# EAGLE design quad-ref-clock (EAGLE 7.4.0)
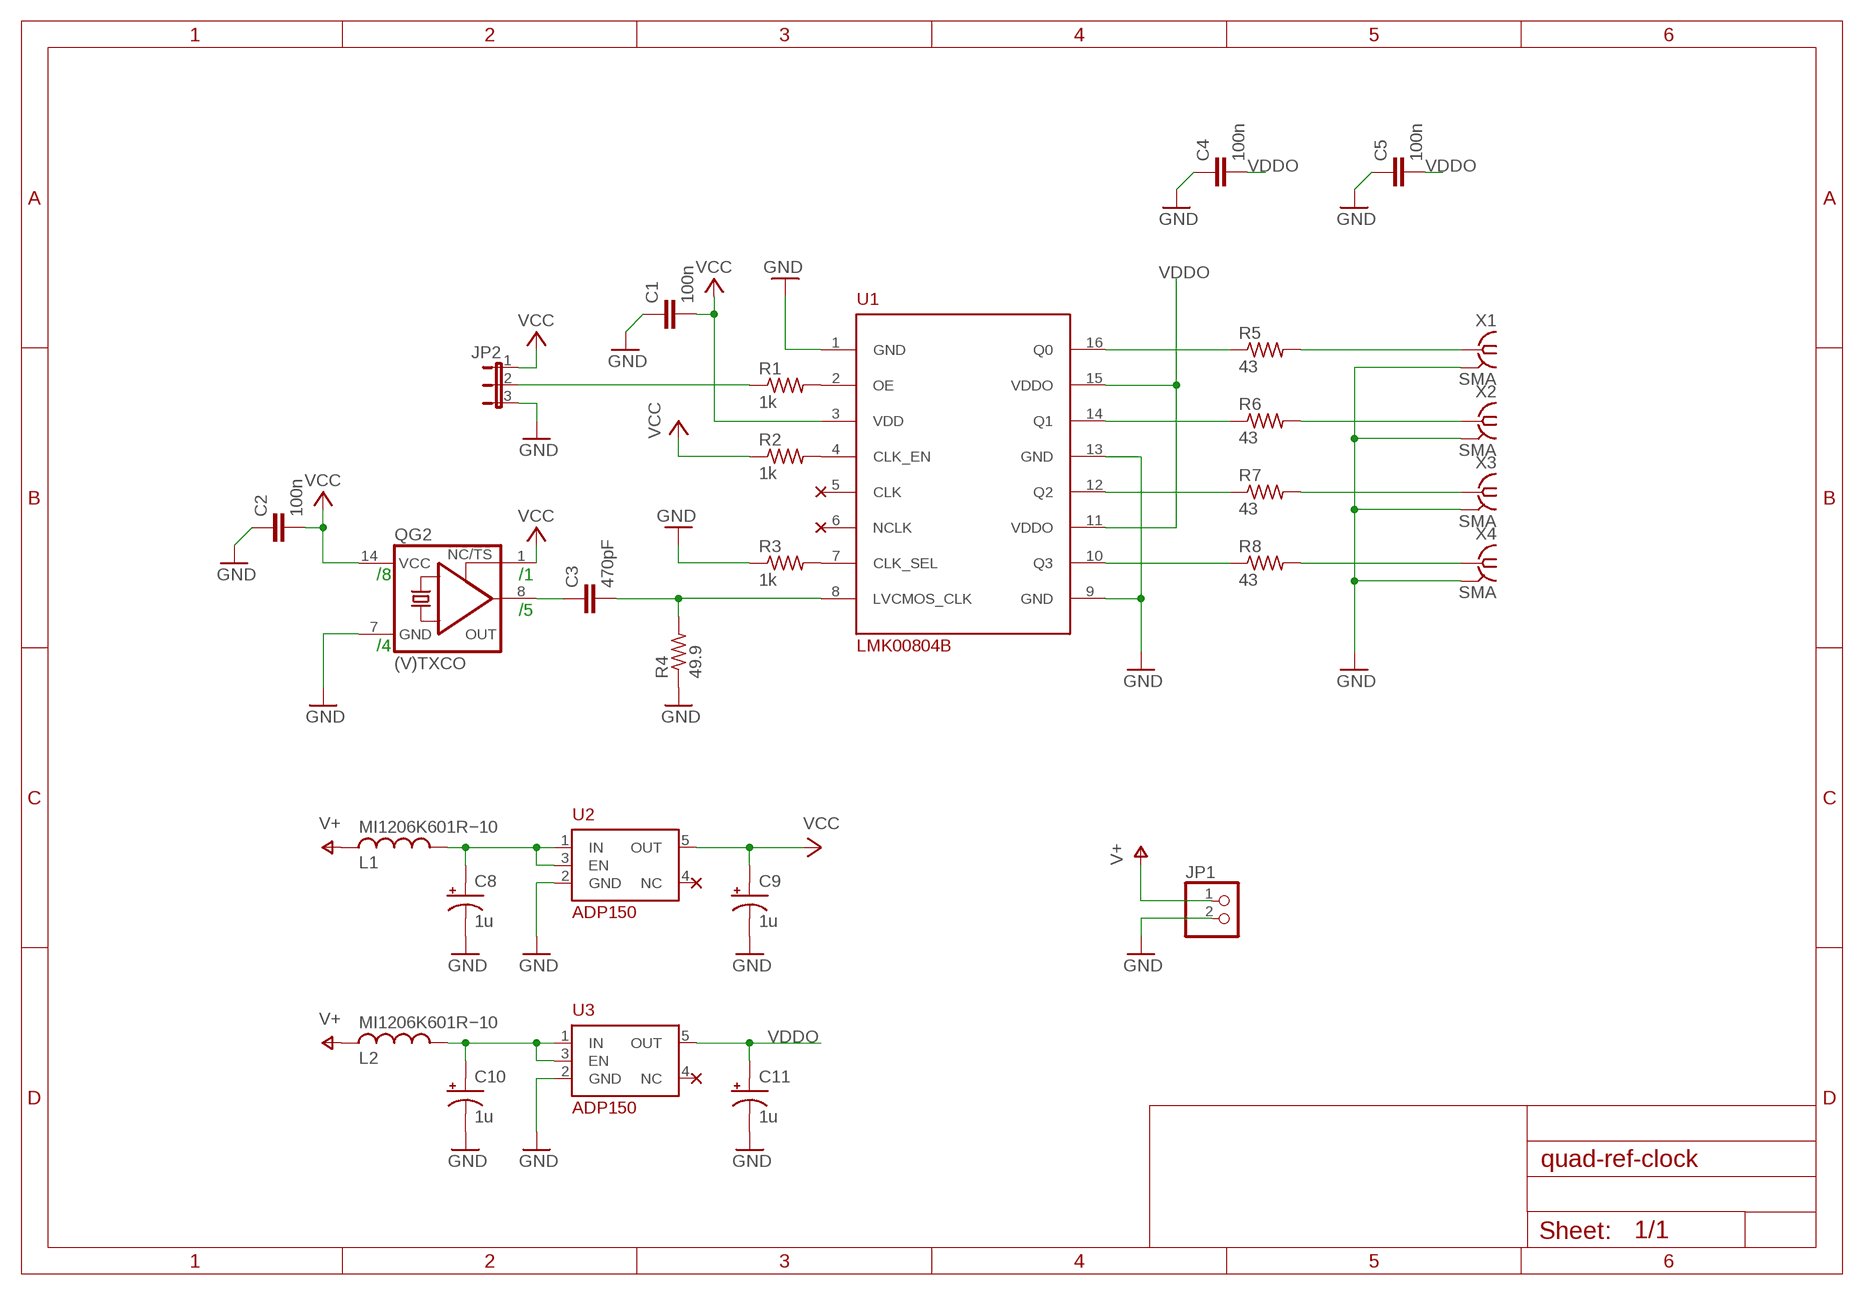
[diagram p0: schematic, sheet 1]

## Parts
C1  100n  C-EUC0805  [C0805]
C2  100n  C-EUC0805  [C0805]
C3  470pF  C-EUC0805  [C0805]
C4  100n  C-EUC0805  [C0805]
C5  100n  C-EUC0805  [C0805]
C8  1u  CAPACITOR_POL1012  [CAPACITOR_POL_1210]
C9  1u  CAPACITOR_POL1012  [CAPACITOR_POL_1210]
C10  1u  CAPACITOR_POL1012  [CAPACITOR_POL_1210]
C11  1u  CAPACITOR_POL1012  [CAPACITOR_POL_1210]
JP1  PINHD-1X2  [1X02]
JP2  JP2E  [JP2]
L1  MI1206K601R−10  L-USL3216C  [L3216C]
L2  MI1206K601R−10  L-USL3216C  [L3216C]
QG2  (V)TXCO  XO-14  [DIL14S]
R1  1k  R-US_R0805  [R0805]
R2  1k  R-US_R0805  [R0805]
R3  1k  R-US_R0805  [R0805]
R4  49.9  R-US_R0603  [R0603]
R5  43  R-US_R0603  [R0603]
R6  43  R-US_R0603  [R0603]
R7  43  R-US_R0603  [R0603]
R8  43  R-US_R0603  [R0603]
U1  LMK00804B  [LMK00804B]
U2  ADP150  [TSOT-23-5]
U3  ADP150  [TSOT-23-5]
U$1  NO-ERC-PAS  (no package)
U$2  NO-ERC-PAS  (no package)
X1  SMA  SMA-142-0711-881/886  [J502-ND-142-0711-881/886]
X2  SMA  SMA-142-0711-881/886  [J502-ND-142-0711-881/886]
X3  SMA  SMA-142-0711-881/886  [J502-ND-142-0711-881/886]
X4  SMA  SMA-142-0711-881/886  [J502-ND-142-0711-881/886]

## Nets
C2: C8.A L1.1 U2.1(IN) U2.3(EN)
GND: C1.1 C2.1 C4.1 C5.1 C8.C C9.C C10.C C11.C JP1.2 JP2.3 QG2.7(GND) R3.1 R4.1 U1.1(GND) U1.9(GND) U1.13(GND) U2.2(GND) U3.2(GND) X1.G@1 X1.G@2 X1.G@3 X1.G@4 X2.G@1 X2.G@2 X2.G@3 X2.G@4 X3.G@1 X3.G@2 X3.G@3 X3.G@4 X4.G@1 X4.G@2 X4.G@3 X4.G@4
N$1: R5.1 U1.16(Q0)
N$2: R6.1 U1.14(Q1)
N$3: R7.1 U1.12(Q2)
N$4: R8.1 U1.10(Q3)
N$5: R2.2 U1.4(CLK_EN)
N$6: R1.2 U1.2(OE)
N$7: C3.2 R4.2 U1.8(LVCMOS_CLK)
N$8: R3.2 U1.7(CLK_SEL)
N$10: R5.2 X1.1
N$11: R6.2 X2.1
N$12: R7.2 X3.1
N$13: R8.2 X4.1
N$14: U1.5(CLK) U$1.0
N$15: C3.1 QG2.8(OUT)
N$16: JP2.2 R1.1
N$17: U1.6(NCLK) U$2.0
N$18: C10.A L2.1 U3.1(IN) U3.3(EN)
V+: JP1.1 L1.2 L2.2
VCC: C1.2 C2.2 C9.A JP2.1 QG2.1(TS) QG2.14(VCC) R2.1 U1.3(VDD) U2.5(OUT)
VDDO: C4.2 C5.2 C11.A U1.11(VDDO) U1.15(VDDO) U3.5(OUT)
Unconnected: U2.4(NC) U3.4(NC)

## Notes on the sheet
- /8 | /1
- /5
- /4

## Library data of the parts
C1-C5 = rcl:C-EU: CAPACITOR, European symbol
C8-C11 = radiotelescope:CAPACITOR_POL
JP1 = pinhead:PINHD-1X2: PIN HEADER
JP2 = jumper:JP2E: JUMPER
L1 L2 = rcl:L-US: INDUCTOR, American symbol
QG2 = crystal:XO-: CRYSTAL; OC_FARNELL: unknown; OC_NEWARK: unknown
R1-R8 = rcl:R-US_: RESISTOR, American symbol
U1 = quad-ref-clock:LMK00804B
U2 U3 = quad-ref-clock:ADP150
U$1 U$2 = quad-ref-clock:NO-ERC-PAS
X1-X4 = con-coax:SMA-: SMA 50 Ohm End Launch Jack Receptacle - Round Contact Johnson Components Source: www.johnsoncomponents.com .. J502-ND.pdf; MF: JOHNSON COMPONENTS; MPN: 142-0711-881; OC_FARNELL: unknown; OC_NEWARK: 50B4464

## Board
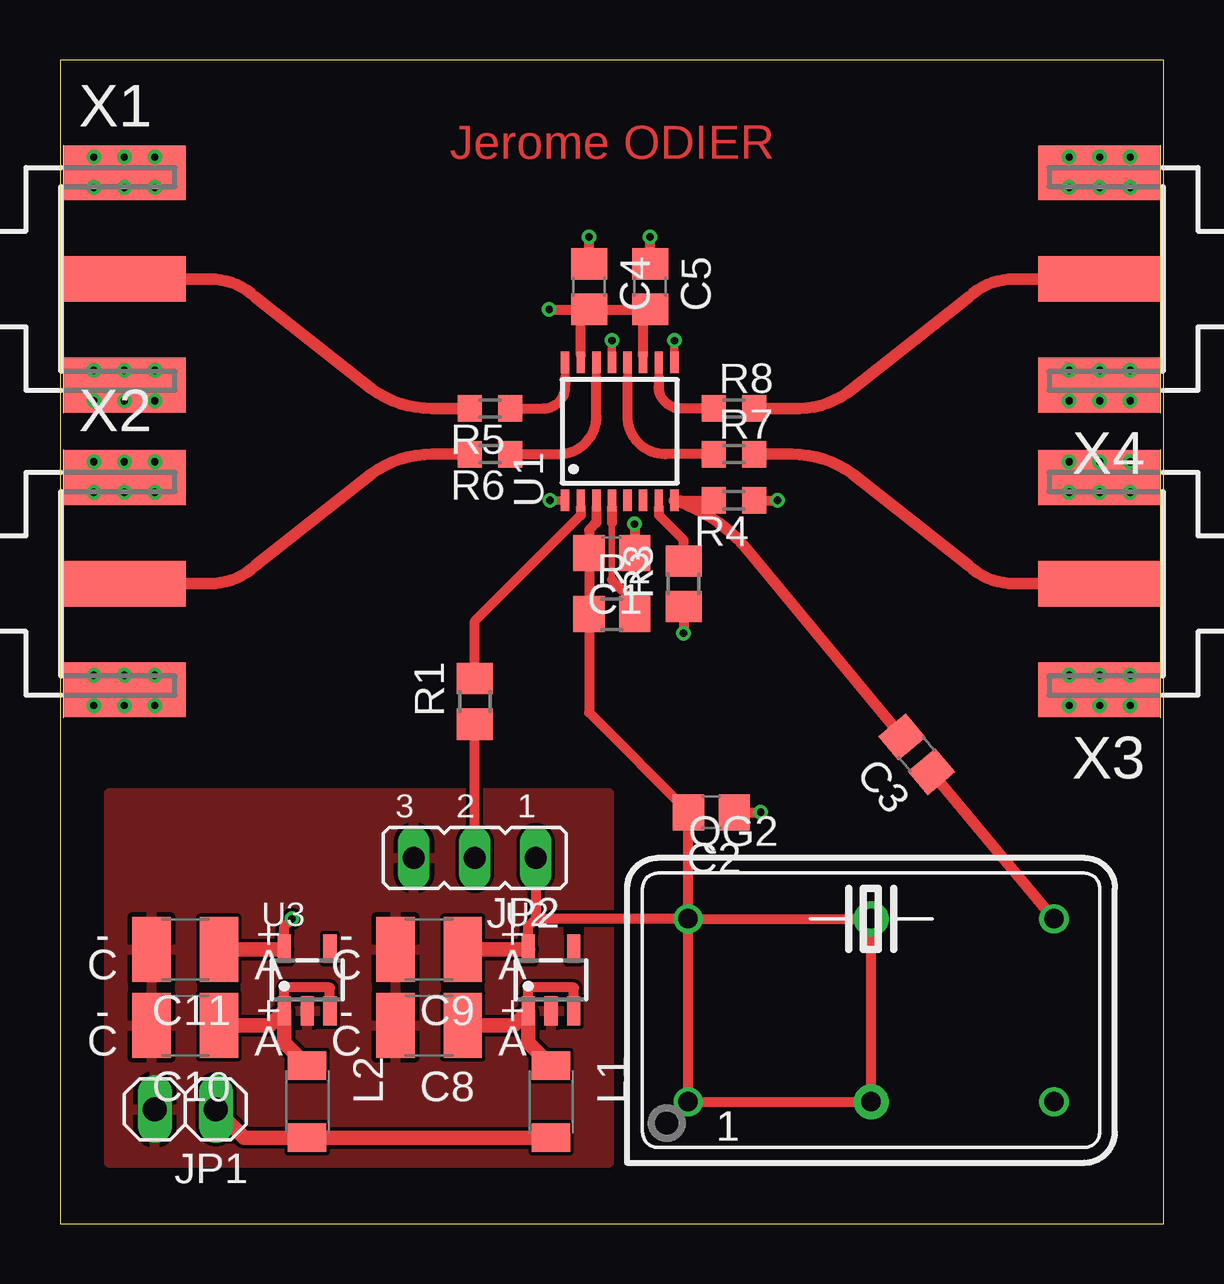
[diagram p1: board, top side]
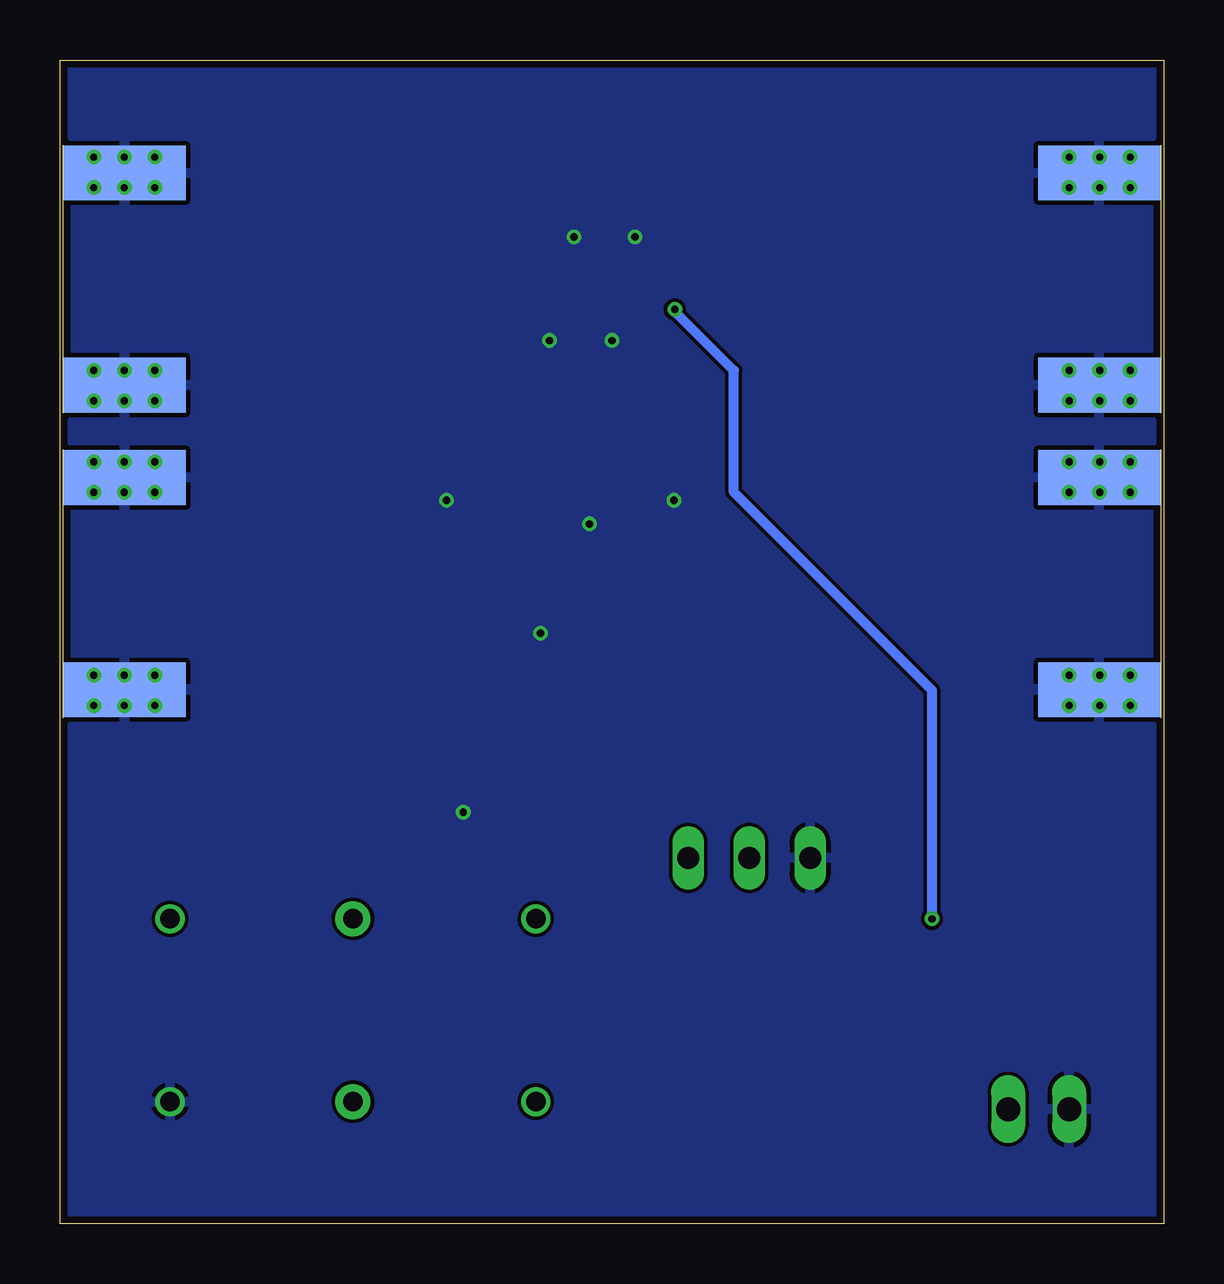
[diagram p2: board, bottom side, seen from below]

Size 46 x 48.5 mm. Coordinates in mm from the lower left corner, seen from the top.
Outline: 0,0 46,0 46,48.5 0,48.5 0,0
Copper layers (1*16): Top 0.035mm / dielectric 1.5mm / Bottom 0.035mm
Design rules "PCB-POOL Standard": minimum track width 0.15mm, minimum drill 0.3mm, track to track 0.15mm, track to pad 0.15mm, pad to pad 0.15mm, via to via 0.15mm, smd to smd 0.15mm, copper to edge 0.3mm, drill to drill 0.2mm, minimum pad ring 0.2mm, minimum via ring 0.15mm, stop-mask expansion 0.075mm, vias tented up to drill 0mil, thermal gap 0.2mm

### Footprints (pad centres in the part's own frame; a part is rotated, then mirrored left to right if it is on the bottom)
C0805 = smd 1.3 x 1.5: 1 -0.95,0; 2 0.95,0
CAPACITOR_POL_1210 = smd 1.6 x 2.7: A -1.4,0; C 1.4,0
1X02 = drill 1.016 long: 1 -1.27,0; 2 1.27,0
JP2 = drill 0.914 long: 1 -2.54,0; 2 0,0; 3 2.54,0
L3216C = smd 1.2 x 1.6: 1 -1.5,0; 2 1.5,0
DIL14S = drill 0.813: 1 -7.62,-3.81; 7 7.62,-3.81; 8 7.62,3.81; 14 -7.62,3.81
R0805 = smd 1.3 x 1.5: 1 -0.95,0; 2 0.95,0
R0603 = smd 1 x 1.1: 1 -0.85,0; 2 0.85,0
LMK00804B = smd 0.9 x 0.35: 1 -2.875,2.275; 2 -2.875,1.625; 3 -2.875,0.975; 4 -2.875,0.325; 5 -2.875,-0.325; 6 -2.875,-0.975; 7 -2.875,-1.625; 8 -2.875,-2.275; 9 2.875,-2.275; 10 2.875,-1.625; 11 2.875,-0.975; 12 2.875,-0.325; 13 2.875,0.325; 14 2.875,0.975; 15 2.875,1.625; 16 2.875,2.275
TSOT-23-5 = smd 0.55 x 1.2: 1 -0.95,-1.3; 2 0,-1.3; 3 0.95,-1.3; 4 0.95,1.3; 5 -0.95,1.3
J502-ND-142-0711-881/886 = smd 5.08 x 1.905: 1 2.565,0 | smd 5.08 x 2.286: G@1 2.565,4.42; G@2 2.565,-4.42 | smd 5.08 x 2.286 bottom: G@3 2.565,4.42; G@4 2.565,-4.42

### Placement (x,y rotation side)
C1  22.99,27.94 180 top
C2  27.14,17.14 180 top
C3  35.7,19.56 130 top
C4  22.05,39.05 270 top
C5  24.59,39.05 270 top
C8  15.38,8.26 180 top
C9  15.38,11.43 180 top
C10  5.22,8.26 180 top
C11  5.22,11.43 180 top
JP1  5.22,4.76 180 top
JP2  17.28,15.24 180 top
L1  20.46,5.08 270 top
L2  10.3,5.08 270 top
QG2  33.79,8.89 0 top
R1  17.28,21.76 90 top
R2  22.99,25.4 0 top
R3  25.98,26.67 90 top
R4  28.08,30.14 180 top
R5  17.92,33.97 180 top
R6  17.92,32.07 180 top
R7  28.08,32.07 0 top
R8  28.08,33.97 0 top
U1  23.32,33.02 90 top
U2  20.46,10.16 0 top
U3  10.3,10.16 0 top
X1  0.14,39.37 0 top
X2  0.14,26.67 0 top
X3  45.86,26.67 180 top
X4  45.86,39.37 180 top

### Tracks (layer width: path | path; a pad name or v marks a point on that pad's centre or on a via)
C2
  Top 0.406: U2.1 19.51,9.84 21.41,9.84 U2.3
  Top 0.61: L1.1 19.51,7.53 U2.1 18.9,8.26 C8.A
GND  (via drill 0.3)
  Top 0.35: v20.42,30.14 U1.1 | U1.13 v23,36.8 | U1.9 v25.6,36.8
  Top 0.406: v23.94,29.16 C1.1 | R3.1 v25.98,24.61 | R4.1 v29.9,30.14 | C4.1 v22.05,41.12 | C5.1 v24.59,41.12 | C2.1 v29.2,17.14
  other vias: 43.32,30.48 43.32,34.29 43.32,35.56 43.32,31.75 42.05,31.75 44.59,31.75 44.59,30.48 42.05,30.48 44.59,34.29 44.59,35.56 42.05,35.56 42.05,34.29 43.32,44.45 43.32,43.18 42.05,43.18 42.05,44.45 44.59,44.45 44.59,43.18 42.05,22.86 43.32,22.86 44.59,22.86 44.59,21.59 43.32,21.59 42.05,21.59 2.68,22.86 3.95,22.86 3.95,21.59 2.68,21.59 1.41,21.59 1.41,22.86 1.41,30.48 2.68,30.48 3.95,30.48 3.95,31.75 2.68,31.75 1.41,31.75 1.41,34.29 2.68,34.29 3.95,34.29 3.95,35.56 2.68,35.56 1.41,35.56 1.41,43.18 2.68,43.18 3.95,43.18 3.95,44.45 2.68,44.45 1.41,44.45
  pour Top: 2.04,17.94 22.87,17.94 22.87,2.54 2.04,2.54
  pour Bottom: 0,48.5 46,48.5 46,0 0,0
  pour Top (no thermals): 41.03,32 45.61,32 45.61,30.23 41.03,30.23
  pour Top (no thermals): 41.03,23.11 45.61,23.11 45.61,21.34 41.03,21.34
  pour Top (no thermals): 41.03,35.81 45.61,35.81 45.61,34.04 41.03,34.04
  pour Top (no thermals): 41.03,44.7 45.61,44.7 45.61,42.93 41.03,42.93
  pour Top (no thermals): 0.39,23.11 4.97,23.11 4.97,21.34 0.39,21.34
  pour Top (no thermals): 0.39,32 4.97,32 4.97,30.23 0.39,30.23
  pour Top (no thermals): 0.39,35.81 4.97,35.81 4.97,34.04 0.39,34.04
  pour Top (no thermals): 0.39,44.7 4.97,44.7 4.97,42.93 0.39,42.93
N$1
  Top 0.35: U1.16 21.05,35.24
  Top 0.406: 21.05,35.24 21.05,34.92 arc-93 20.14,33.97 R5.1
N$2
  Top 0.35: U1.14 22.35,35.24
  Top 0.406: R6.1 20.78,32.07 arc91 22.35,33.66 22.35,35.24
N$3
  Top 0.35: U1.12 23.65,35.24
  Top 0.406: R7.1 25.22,32.07 arc-91 23.65,33.66 23.65,35.24
N$4
  Top 0.35: U1.10 24.95,35.24
  Top 0.406: 24.95,35.24 24.95,34.92 arc93 25.86,33.97 R8.1
N$5
  Top 0.279: 23,29.21 23,26.83
  Top 0.35: U1.4 23,29.84
  Top 0.406: 23,29.84 23,29.21 | R2.2 23.94,25.89 23,26.83
N$6
  Top 0.35: U1.2 21.7,29.84
  Top 0.406: 21.7,29.84 21.7,29.53 17.28,25.11 R1.2
N$7
  Top 0.35: U1.8 25.86,30.14
  Top 0.406: 25.86,30.14 R4.2
  Top 0.483: C3.2 28.61,28.12 arc33 U1.8
N$8
  Top 0.35: U1.7 24.95,29.84
  Top 0.406: R3.2 25.98,28.49 24.95,29.53 24.95,29.84
N$10
  Top 0.483: R5.2 15.51,33.97 arc-36 12.97,34.8 8.14,38.61 arc44 6.24,39.37 X1.1
N$11
  Top 0.483: R6.2 15.51,32.07 arc36 12.97,31.24 8.14,27.43 arc-44 6.24,26.67 X2.1
N$12
  Top 0.483: X3.1 39.76,26.67 arc-44 37.86,27.43 33.03,31.24 arc36 30.49,32.07 R7.2
N$13
  Top 0.483: X4.1 39.76,39.37 arc44 37.86,38.61 33.03,34.8 arc-42 30.49,33.97 R8.2
N$15
  Top 0.483: QG2.8 C3.1
N$16
  Top 0.406: JP2.2 R1.1
N$18
  Top 0.406: U3.1 9.35,9.84 11.25,9.84 U3.3
  Top 0.61: L2.1 9.35,7.53 U3.1 8.74,8.26 C10.A
V+
  Top 0.61: L1.2 L2.2 7.67,3.58 JP1.1
VCC  (via drill 0.81)
  Top 0.35: U1.3 22.35,29.84
  Top 0.406: QG2.14 19.82,12.7 | QG2.14 v33.79,12.7 v33.79,5.08 QG2.1 QG2.14 | 19.51,11.43 U2.5 19.51,12.38 19.82,12.7 | QG2.14 26.17,17.13 C2.2 22.04,21.29 R2.1 C1.2 22.04,28.9 22.35,29.21 22.35,29.84 | JP2.1 19.82,12.7
  Top 0.61: C9.A 19.51,11.43
VDDO  (via drill 0.3)
  Top 0.35: U1.15 21.7,36.2 | U1.11 24.3,36.2
  Top 0.406: 9.32,11.43 U3.5 9.35,12.38 v9.66,12.7 | C4.2 C5.2 24.3,37.81 24.3,36.2 | C4.2 arc-90 21.66,38.1 | 21.7,36.2 21.7,37.76 C4.2 | v20.38,38.1 C4.2
  Top 0.61: C11.A 9.32,11.43
  Bottom 0.406: v20.38,38.1 20.46,38.1 17.92,35.56 17.92,30.48 9.66,22.23 v9.66,12.7

### Text on the board
Top: Jerome ODIER